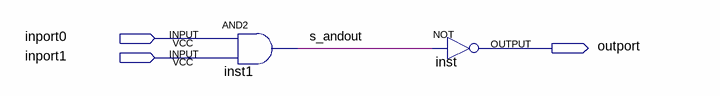
[diagram p0: schematic sheet]
// Quartus schematic NANDHome.bdf as structural Verilog: 2 symbols, 3 pins
module NANDHome (
  input  inport0,
  input  inport1,
  output outport
);

  wire s_andout;

  and inst1 (s_andout, inport0, inport1);
  not inst (outport, s_andout);
endmodule
